# EasyEDA schematic SCH_Liz_2025-01-02.json

## Sheets
1 Liz Sensor Voltmeter: TITLE: Liz Sensor Voltmeter; REV: 1.1; Date: 2025-01-02; Sheet: 1/1; Drawn By: Sondre Sjølyst; Company: Sjølyst Innovations
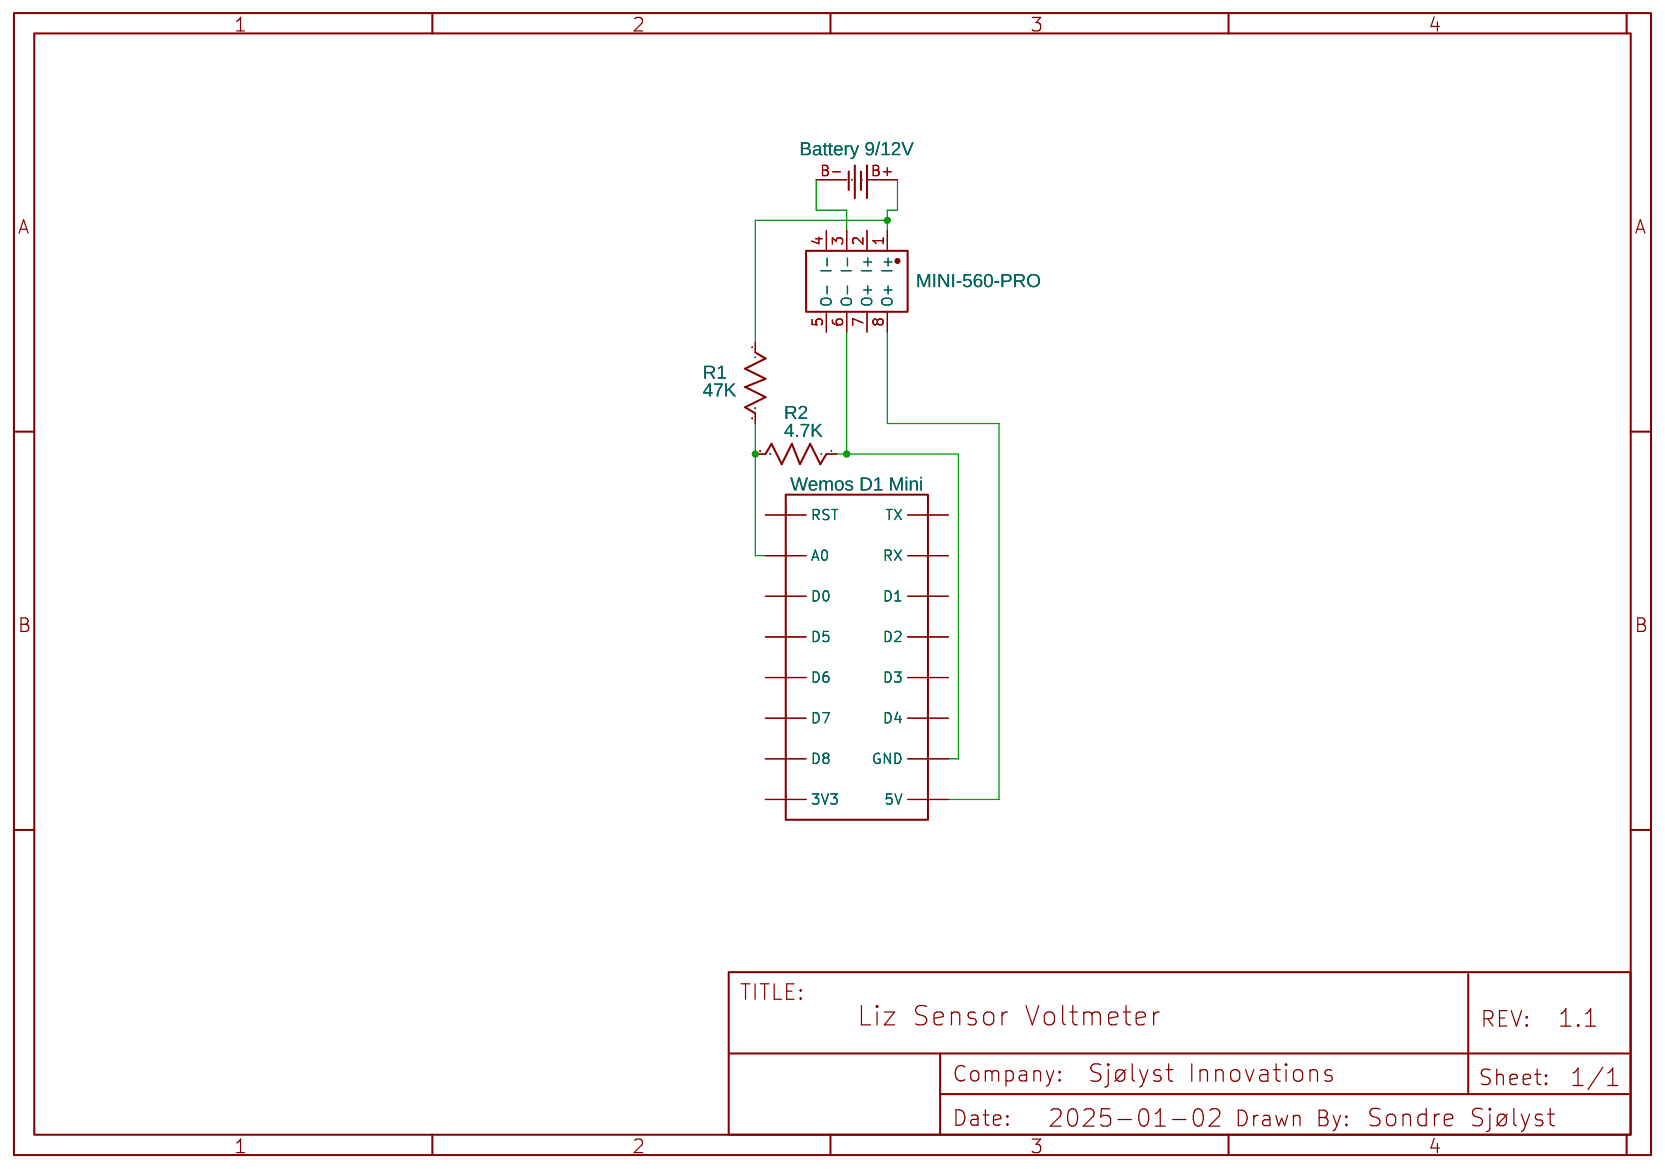
[diagram p0: Liz Sensor Voltmeter]
2 Liz Sensor BME280: TITLE: Liz Sensor BME280; REV: 1.0; Date: 2024-12-03
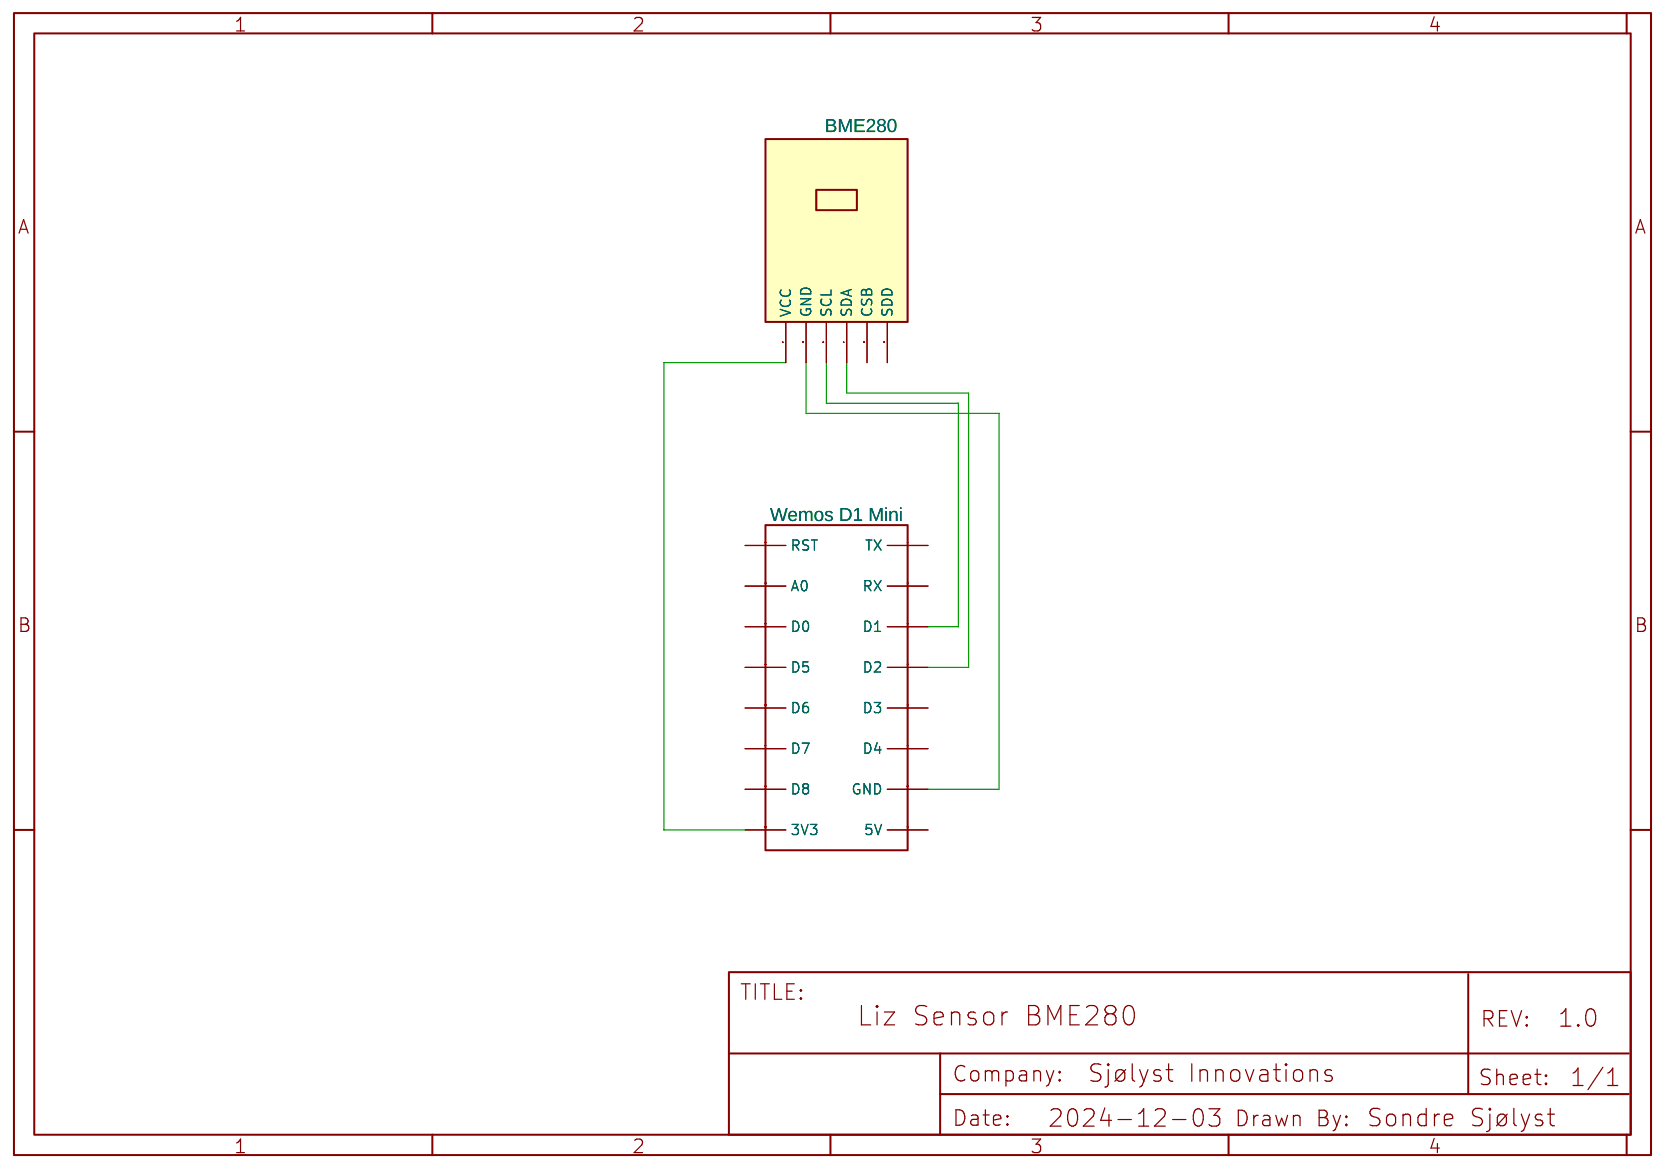
[diagram p1: Liz Sensor BME280]

## Parts
sheet Liz Sensor BME280
S1  BME280  [BME280]
U1#2  Wemos D1 Mini  [WEMOS D1 MINI V3]
sheet Liz Sensor Voltmeter
B1  Battery 9/12V  [BAT-SMD_CR1220-2]
R1  47K  [R0603]
R2  4.7K  [R0603]
U1  Wemos D1 Mini  [WEMOS D1 MINI V3]
U2  MINI-560-PRO  [MINI560PRO-FOOTPRINT]

## Library data of the parts
S1 = BME280
U1 U1#2 = Wemos D1 Mini: Contributor: sonyslyst
B1 = CR1220-2: Supplier: LCSC; Manufacturer: Q&J; image: //image.lceda.cn/szlcsc/C70381.jpg; Supplier Part: C70381
R1 R2 = R_0603_US: Contributor: LCEDA_Lib
U2 = MINI-560-PRO: Contributor: sonyslyst

## Nets
Net-(B1-B+): B1.B+(1) R1.1 U2.1(I+)
Net-(B1-B-): B1.B-(2) U2.3(I-)
Net-(R1-2): R1.2 R2.2 U1.A0
Net-(R2-1): R2.1 U1.GND U2.6(O-)
Net-(S1-1): S1.1(VCC) U1#2.3V3
Net-(S1-2): S1.2(GND) U1#2.GND
Net-(S1-3): S1.3(SCL) U1#2.D1
Net-(S1-4): S1.4(SDA) U1#2.D2
Net-(U1-5V): U1.5V U2.8(O+)

Not connected (* = marked no-connect by the designer): S1 5(CSB) 6(SDD); U1 3V3 D0 D1 D2 D3 D4 D5 D6 D7 D8 RST RX TX; U1#2 5V A0 D0 D3 D4 D5 D6 D7 D8 RST RX TX; U2 2(I+) 4(I-) 5(O-) 7(O+)
